# Altium schematic sheet IOT_Gas.SchDoc
size A4
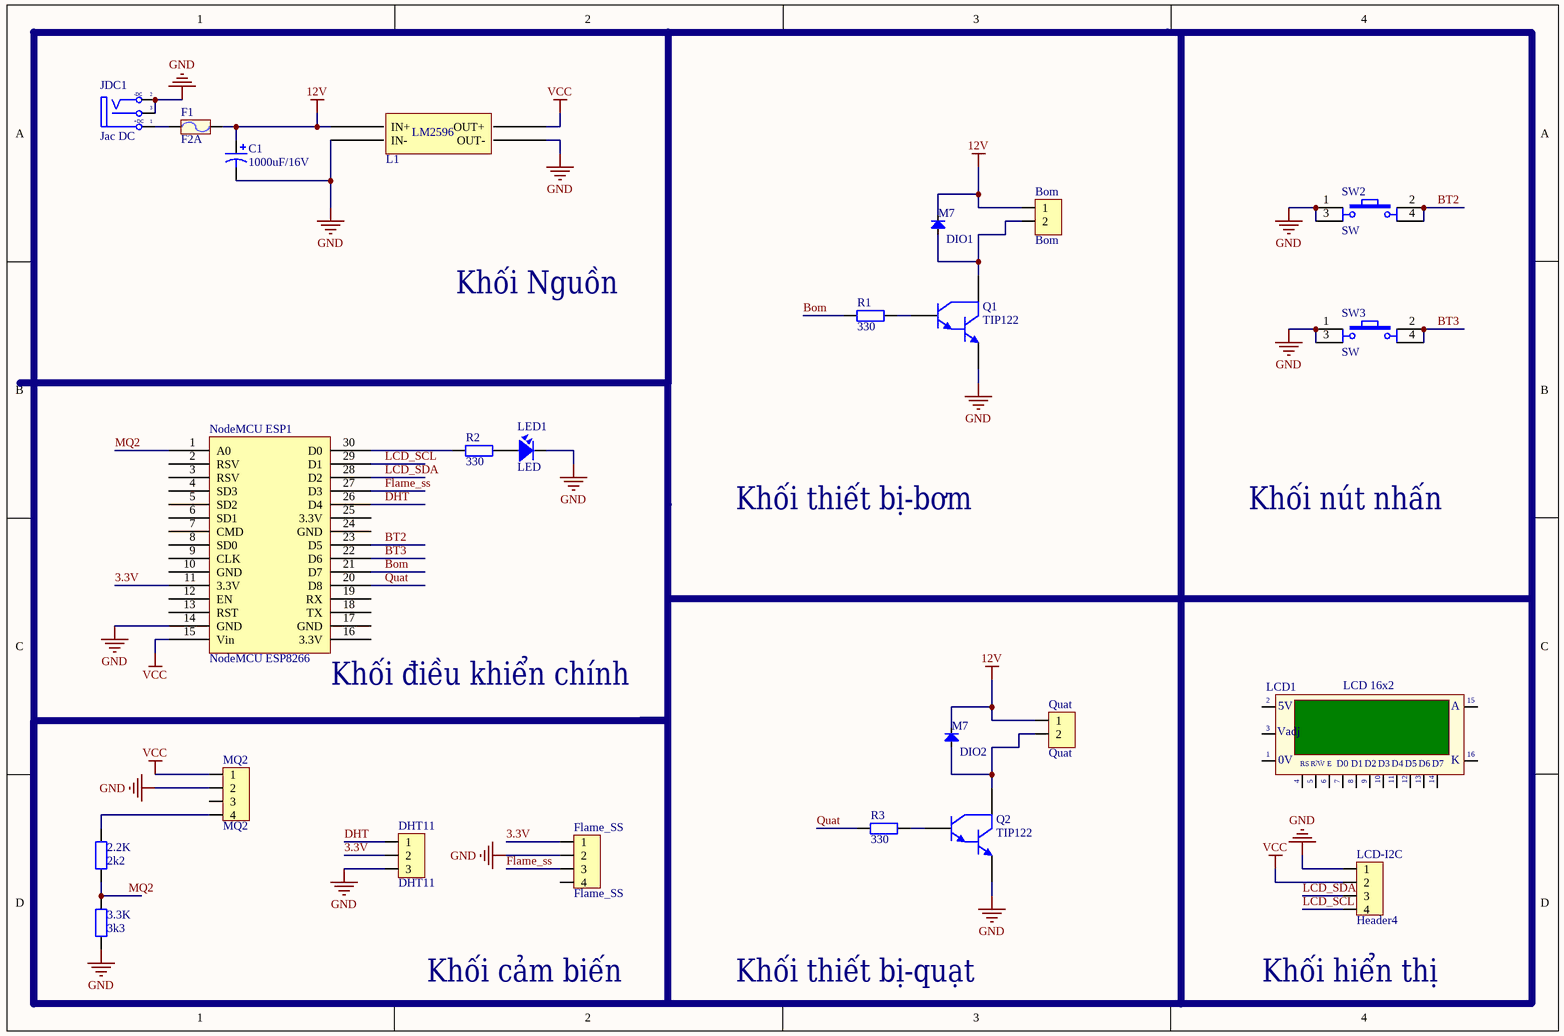
[diagram p0: IOT_Gas.SchDoc]

## Parts
2.2K  2k2  [DIEN TRO 0805]
3.3K  3k3  [DIEN TRO 0805]
Bom  Bom  [Header2]
C1  1000uF/16V  [C10mm]
DHT11  DHT11  [Header3]
DIO1  M7  [DIO-SMD-106]
DIO2  M7  [DIO-SMD-106]
F1  F2A  [Fuse]
Flame_SS  Flame_SS  [HDR4]
JDC1  Jac DC  [DC-IN]
L1  BUCK_LM2596  [BUCK_LM2596]  (value not drawn)
LCD1  LCD 16x2  [LCD16X2N]
LCD-I2C  Header4  [HDR4]
LED1  LED  [LED-5 GRe]
MQ2  MQ2  [HDR4]
NodeMCU_ESP1  NodeMCU ESP8266  [NodeMCU ESP8266]
Q1  TIP122  [QTO-220]
Q2  TIP122  [QTO-220]
Quat  Quat  [Header2]
R1  330  [DIEN TRO 0805]
R2  330  [DIEN TRO 0805]
R3  330  [DIEN TRO 0805]
SW2  SW  [SW4]
SW3  SW  [SW4]

## Nets
12V: Bom.1 C1.1 DIO1.2(K) DIO2.2(K) F1.2 L1.1(IN+) Quat.1
GND: 3.3K.2 C1.2 DHT11.3 Flame_SS.2 JDC1.2(TN) JDC1.3(S) L1.2(IN-) L1.3(OUT-) LCD-I2C.1 LED1.2 MQ2.2 NodeMCU_ESP1.14(GND) Q1.3(E) Q2.3(E) SW2.1 SW2.3 SW3.1 SW3.3
VCC: L1.4(OUT+) LCD-I2C.2 MQ2.1 NodeMCU_ESP1.15(Vin)
3.3V: DHT11.2 Flame_SS.1 NodeMCU_ESP1.11(3.3V)
Bom: NodeMCU_ESP1.21(D7) R1.2
BT2: NodeMCU_ESP1.23(D5) SW2.2 SW2.4
BT3: NodeMCU_ESP1.22(D6) SW3.2 SW3.4
DHT: DHT11.1 NodeMCU_ESP1.26(D4)
Flame_ss: Flame_SS.3 NodeMCU_ESP1.27(D3)
LCD_SCL: LCD-I2C.4 NodeMCU_ESP1.29(D1)
LCD_SDA: LCD-I2C.3 NodeMCU_ESP1.28(D2)
MQ2: 2.2K.2 3.3K.1 NodeMCU_ESP1.1(A0)
Quat: NodeMCU_ESP1.20(D8) R3.2
Net2.2K_1: 2.2K.1 MQ2.4
NetBom_2: Bom.2 DIO1.1(A) Q1.2(C)
NetDIO2_1: DIO2.1(A) Q2.2(C) Quat.2
NetF1_1: F1.1 JDC1.1(T)
NetLED1_1: LED1.1 R2.1
NetNodeMCU_ESP1_30: NodeMCU_ESP1.30(D0) R2.2
NetQ1_1: Q1.1(B) R1.1
NetQ2_1: Q2.1(B) R3.1

Not connected (* = marked no-connect by the designer): Flame_SS 4; LCD1 1(GND) 2(VDD) 3(VAdj) 4(RS) 5(R/~{W}) 6(~{EN}) 7(D0) 8(D1) 9(D2) 10(D3) 11(D4) 12(D5) 13(D6) 14(D7) 15(A) 16(K); MQ2 3; NodeMCU_ESP1 2(RSV) 3(RSV) 4(SD3) 5(SD2) 6(SD1) 7(CMD) 8(SD0) 9(CLK) 10(GND) 12(EN) 13(RST) 16(3.3V) 17(GND) 18(TX) 19(RX) 24(GND) 25(3.3V)

## Notes on the sheet
- Khối Nguồn
- Khối thiết bị-bơm
- Khối nút nhấn
- (near NodeMCU_ESP1) Khối điều khiển chính
- Khối cảm biến
- Khối thiết bị-quạt
- (near LCD-I2C) Khối hiển thị
- (in symbol BUCK_LM2596) LM2596
- (in symbol DCIN) -DC; +DC
- (in symbol LCD) 5V; Vadj; |; 0V; R/W; E

## Library data of the parts
2.2K 3.3K R1-R3 = R0805: Resistor SMD 0805; Published: 8-Jun-2000; LatestRevisionDate: 17-Jul-2002; LatestRevisionNote: Re-released for DXP Platform.; PackageReference: AXIAL-0.4; Publisher: Altium Limited
Bom Quat = Header2: Header IDC, 2 x 1 Pin Vertical 2.54mm Pitch (Non-Boxed, Male); Manufacturer: W¨¹rth Elektronik eiSos GmbH; partNo: 613002143121; ComponentLink1 Description: Manufacturer; ComponentLink2 Description: Datasheet; NoPins: 02; Created Date: 29 March 2013; ComponentLink1URL: http://www.we-online.com; ComponentLink2URL: http://katalog.we-online.de/em/datasheet/6130xx143121.pdf; Created by: Karrer Zheng
C1 = Cap Pol 12mm: Polarized Capacitor (Axial); Published: 8-Jun-2000; LatestRevisionDate: 17-Jul-2002; LatestRevisionNote: Re-released for DXP Platform.; PackageReference: POLAR0.8; Publisher: Altium Limited
DHT11 = Header3: Header IDC, 3 x 1 Pin Vertical 2.54mm Pitch (Non-Boxed, Male); Manufacturer: W¨¹rth Elektronik eiSos GmbH; partNo: 613002143121; ComponentLink1 Description: Manufacturer; ComponentLink2 Description: Datasheet; NoPins: 02; Created Date: 29 March 2013; ComponentLink1URL: http://www.we-online.com; ComponentLink2URL: http://katalog.we-online.de/em/datasheet/6130xx143121.pdf; Created by: Karrer Zheng
DIO1 DIO2 = Diode SMD: Default Diode; Code - JEDEC: DO-214-AB; Value: 1N5007; Published: 8-Jun-2000; Revision: July-2002: Re-released for DXP Platform.; Publisher: Altium Limited
F1 = Fuse: Designed by: VanDungEvn; Value: Fuse
Flame_SS LCD-I2C MQ2 = Header4: Header IDC, 4 x 1 Pin Vertical 2.54mm Pitch (Non-Boxed, Male); Manufacturer: W¨¹rth Elektronik eiSos GmbH; partNo: 613002143121; ComponentLink1 Description: Manufacturer; ComponentLink2 Description: Datasheet; NoPins: 02; Created Date: 29 March 2013; ComponentLink1URL: http://www.we-online.com; ComponentLink2URL: http://katalog.we-online.de/em/datasheet/6130xx143121.pdf; Created by: Karrer Zheng
JDC1 = DCIN: Jac DC input; Value: Jac DC
LCD1 = LCD
LED1 = LED: LED Single colour Green and Red; Value: LED 3 ly Single Colour
Q1 Q2 = TIP122: Darlington Silicon Power NPN Transistor, 8 Amp, 100 Volts and 65 Watts
SW2 SW3 = SW4: Switch button 4 pin; Value: Button chip 4 pin